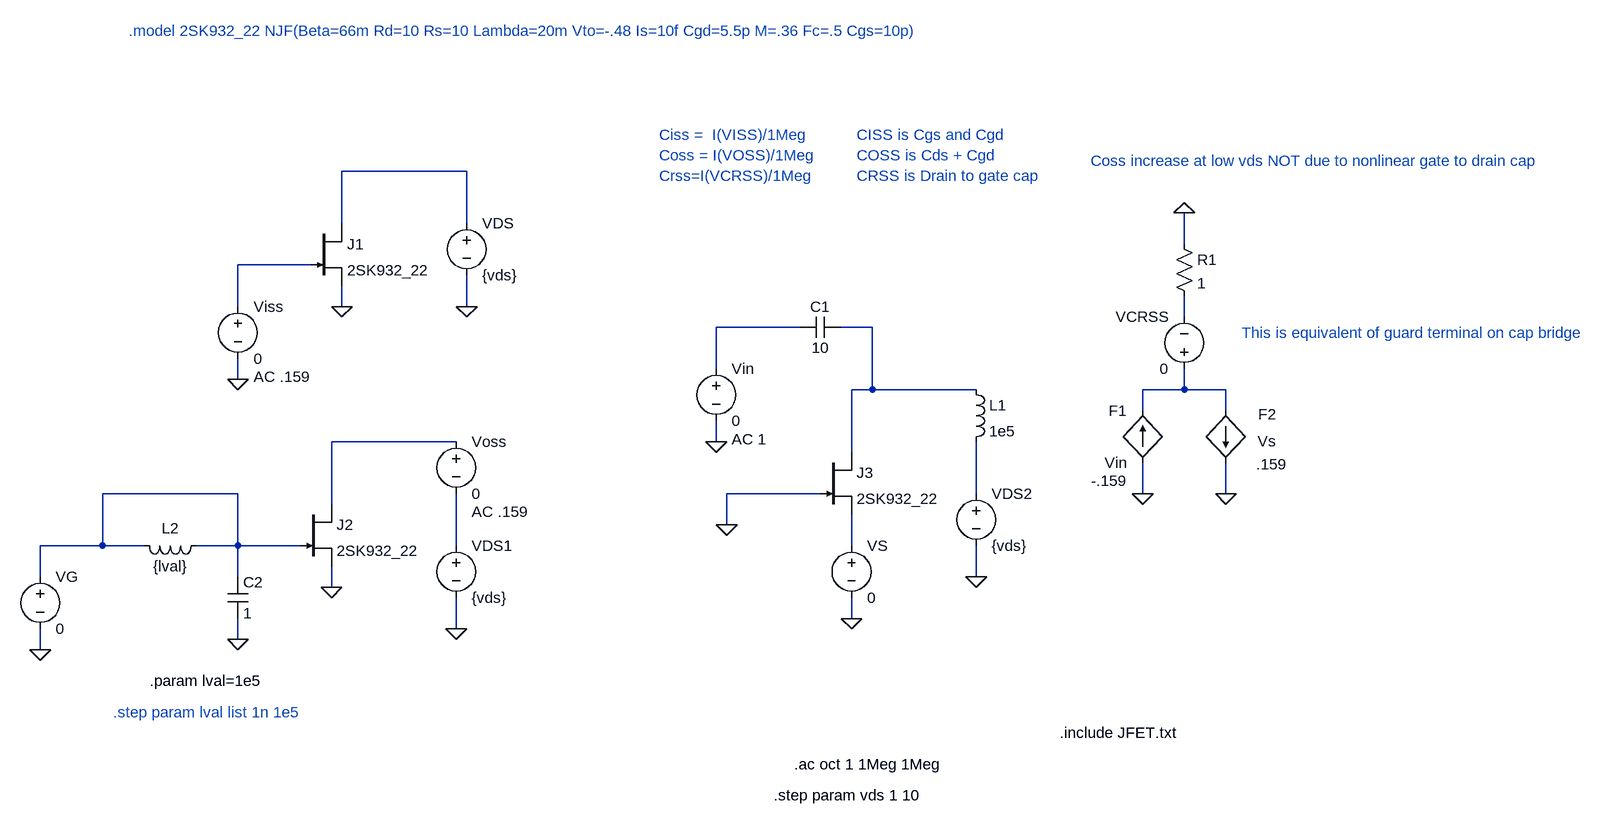
[diagram p0: schematic JFET_CapAC.asc]
JFET_CapAC.asc, the LTspice schematic file:
Version 4
SHEET 1 3088 1024
WIRE 432 48 240 48
WIRE 240 128 240 48
WIRE 432 128 432 48
WIRE 1536 160 1536 112
WIRE 192 192 80 192
WIRE 80 256 80 192
WIRE 240 256 240 224
WIRE 432 256 432 208
WIRE 1536 272 1536 240
WIRE 944 288 816 288
WIRE 1056 288 1008 288
WIRE 816 352 816 288
WIRE 80 368 80 336
WIRE 1056 384 1056 288
WIRE 1056 384 1024 384
WIRE 1216 384 1056 384
WIRE 1536 384 1536 352
WIRE 1536 384 1472 384
WIRE 1600 384 1536 384
WIRE 1472 416 1472 384
WIRE 1600 416 1600 384
WIRE 416 464 224 464
WIRE 816 464 816 432
WIRE 1024 480 1024 384
WIRE 80 544 -128 544
WIRE 976 544 832 544
WIRE 1216 544 1216 464
WIRE 1472 544 1472 496
WIRE 1600 544 1600 496
WIRE 224 560 224 464
WIRE 832 592 832 544
WIRE -128 624 -128 544
WIRE -128 624 -224 624
WIRE -64 624 -128 624
WIRE 80 624 80 544
WIRE 80 624 16 624
WIRE 176 624 80 624
WIRE 416 624 416 544
WIRE 1024 624 1024 576
WIRE -224 672 -224 624
WIRE 80 672 80 624
WIRE 1216 672 1216 624
WIRE 224 688 224 656
WIRE 1024 736 1024 704
WIRE 416 752 416 704
WIRE 80 768 80 736
WIRE -224 784 -224 752
FLAG 240 256 0
FLAG 80 368 0
FLAG 432 256 0
FLAG -224 784 0
FLAG 416 752 0
FLAG 1024 736 0
FLAG 1216 672 0
FLAG 832 592 0
FLAG 816 464 0
FLAG 1536 112 0
FLAG 1472 544 0
FLAG 1600 544 0
FLAG 80 768 0
FLAG 224 688 0
SYMBOL voltage 80 240 R0
WINDOW 123 24 124 Left 2
WINDOW 39 0 0 Left 2
SYMATTR Value2 AC .159
SYMATTR InstName Viss
SYMATTR Value 0
SYMBOL voltage 432 112 R0
WINDOW 123 0 0 Left 2
WINDOW 39 0 0 Left 2
SYMATTR InstName VDS
SYMATTR Value {vds}
SYMBOL voltage -224 656 R0
WINDOW 123 24 124 Left 2
WINDOW 39 0 0 Left 2
SYMATTR InstName VG
SYMATTR Value 0
SYMBOL voltage 416 608 R0
WINDOW 123 0 0 Left 2
WINDOW 39 0 0 Left 2
SYMATTR InstName VDS1
SYMATTR Value {vds}
SYMBOL voltage 416 448 R0
WINDOW 123 24 124 Left 2
WINDOW 39 0 0 Left 2
SYMATTR Value2 AC .159
SYMATTR InstName Voss
SYMATTR Value 0
SYMBOL voltage 1024 608 R0
WINDOW 123 24 124 Left 2
WINDOW 39 0 0 Left 2
SYMATTR InstName VS
SYMATTR Value 0
SYMBOL voltage 1216 528 R0
WINDOW 123 0 0 Left 2
WINDOW 39 0 0 Left 2
SYMATTR InstName VDS2
SYMATTR Value {vds}
SYMBOL ind 1200 368 R0
SYMATTR InstName L1
SYMATTR Value 1e5
SYMBOL voltage 816 336 R0
WINDOW 123 24 124 Left 2
WINDOW 39 0 0 Left 2
SYMATTR Value2 AC 1
SYMATTR InstName Vin
SYMATTR Value 0
SYMBOL cap 1008 272 R90
WINDOW 0 0 32 VBottom 2
WINDOW 3 32 32 VTop 2
SYMATTR InstName C1
SYMATTR Value 10
SYMBOL f 1472 496 R180
WINDOW 0 24 80 Left 2
WINDOW 3 24 0 Left 2
WINDOW 123 24 -28 Left 2
SYMATTR InstName F1
SYMATTR Value Vin
SYMATTR Value2 -.159
SYMBOL f 1600 416 R0
WINDOW 0 50 6 Left 2
WINDOW 3 49 47 Left 2
WINDOW 123 47 83 Left 2
SYMATTR InstName F2
SYMATTR Value Vs
SYMATTR Value2 .159
SYMBOL voltage 1536 368 R180
WINDOW 0 24 96 Left 2
WINDOW 3 24 16 Left 2
SYMATTR InstName VCRSS
SYMATTR Value 0
SYMBOL res 1520 144 R0
SYMATTR InstName R1
SYMATTR Value 1
SYMBOL ind 32 608 R90
WINDOW 0 5 56 VBottom 2
WINDOW 3 32 56 VTop 2
SYMATTR InstName L2
SYMATTR Value {lval}
SYMBOL cap 64 672 R0
SYMATTR InstName C2
SYMATTR Value 1
SYMBOL njf 192 128 R0
SYMATTR InstName J1
SYMATTR Value 2SK932_22
SYMBOL njf 176 560 R0
SYMATTR InstName J2
SYMATTR Value 2SK932_22
SYMBOL njf 976 480 R0
SYMATTR InstName J3
SYMATTR Value 2SK932_22
TEXT 936 960 Left 2 !.ac oct 1 1Meg 1Meg
TEXT 728 -8 Left 2 ;Ciss =  I(VISS)/1Meg\nCoss = I(VOSS)/1Meg\nCrss=I(VCRSS)/1Meg
TEXT 904 1008 Left 2 !.step param vds 1 10
TEXT 1624 296 Left 2 ;This is equivalent of guard terminal on cap bridge
TEXT 1032 -8 Left 2 ;CISS is Cgs and Cgd\nCOSS is Cds + Cgd\nCRSS is Drain to gate cap
TEXT -112 880 Left 2 ;.step param lval list 1n 1e5
TEXT -56 832 Left 2 !.param lval=1e5
TEXT 1392 32 Left 2 ;Coss increase at low vds NOT due to nonlinear gate to drain cap
TEXT 1344 912 Left 2 !.include JFET.txt
TEXT -88 -168 Left 2 ;.model 2SK932_22 NJF(Beta=66m Rd=10 Rs=10 Lambda=20m Vto=-.48 Is=10f Cgd=5.5p M=.36 Fc=.5 Cgs=10p)

The netlist it stands for:
* JFET_CapAC.asc
Viss N002 0 0 AC .159
VDS N001 0 {vds}
VG N008 0 0
VDS1 N010 0 {vds}
Voss N007 N010 0 AC .159
VS N011 0 0
VDS2 N009 0 {vds}
L1 N005 N009 1e5
Vin N004 0 0 AC 1
C1 N005 N004 10
F1 0 N006 Vin -.159
F2 N006 0 Vs .159
VCRSS N006 N003 0
R1 0 N003 1
L2 N008 N008 {lval}
C2 N008 0 1
J1 N001 N002 0 2SK932_22
J2 N007 N008 0 2SK932_22
J3 N005 0 N011 2SK932_22
.model NJF NJF
.model PJF PJF
.lib standard.jft
.ac oct 1 1Meg 1Meg
* Ciss =  I(VISS)/1Meg
* Coss = I(VOSS)/1Meg
* Crss=I(VCRSS)/1Meg
.step param vds 1 10
* This is equivalent of guard terminal on cap bridge
* CISS is Cgs and Cgd
* COSS is Cds + Cgd
* CRSS is Drain to gate cap
* .step param lval list 1n 1e5
.param lval=1e5
* Coss increase at low vds NOT due to nonlinear gate to drain cap
.include JFET.txt
* .model 2SK932_22 NJF(Beta=66m Rd=10 Rs=10 Lambda=20m Vto=-.48 Is=10f Cgd=5.5p M=.36 Fc=.5 Cgs=10p)
.backanno
.end